# EAGLE design melvins board (EAGLE 9.2.2)
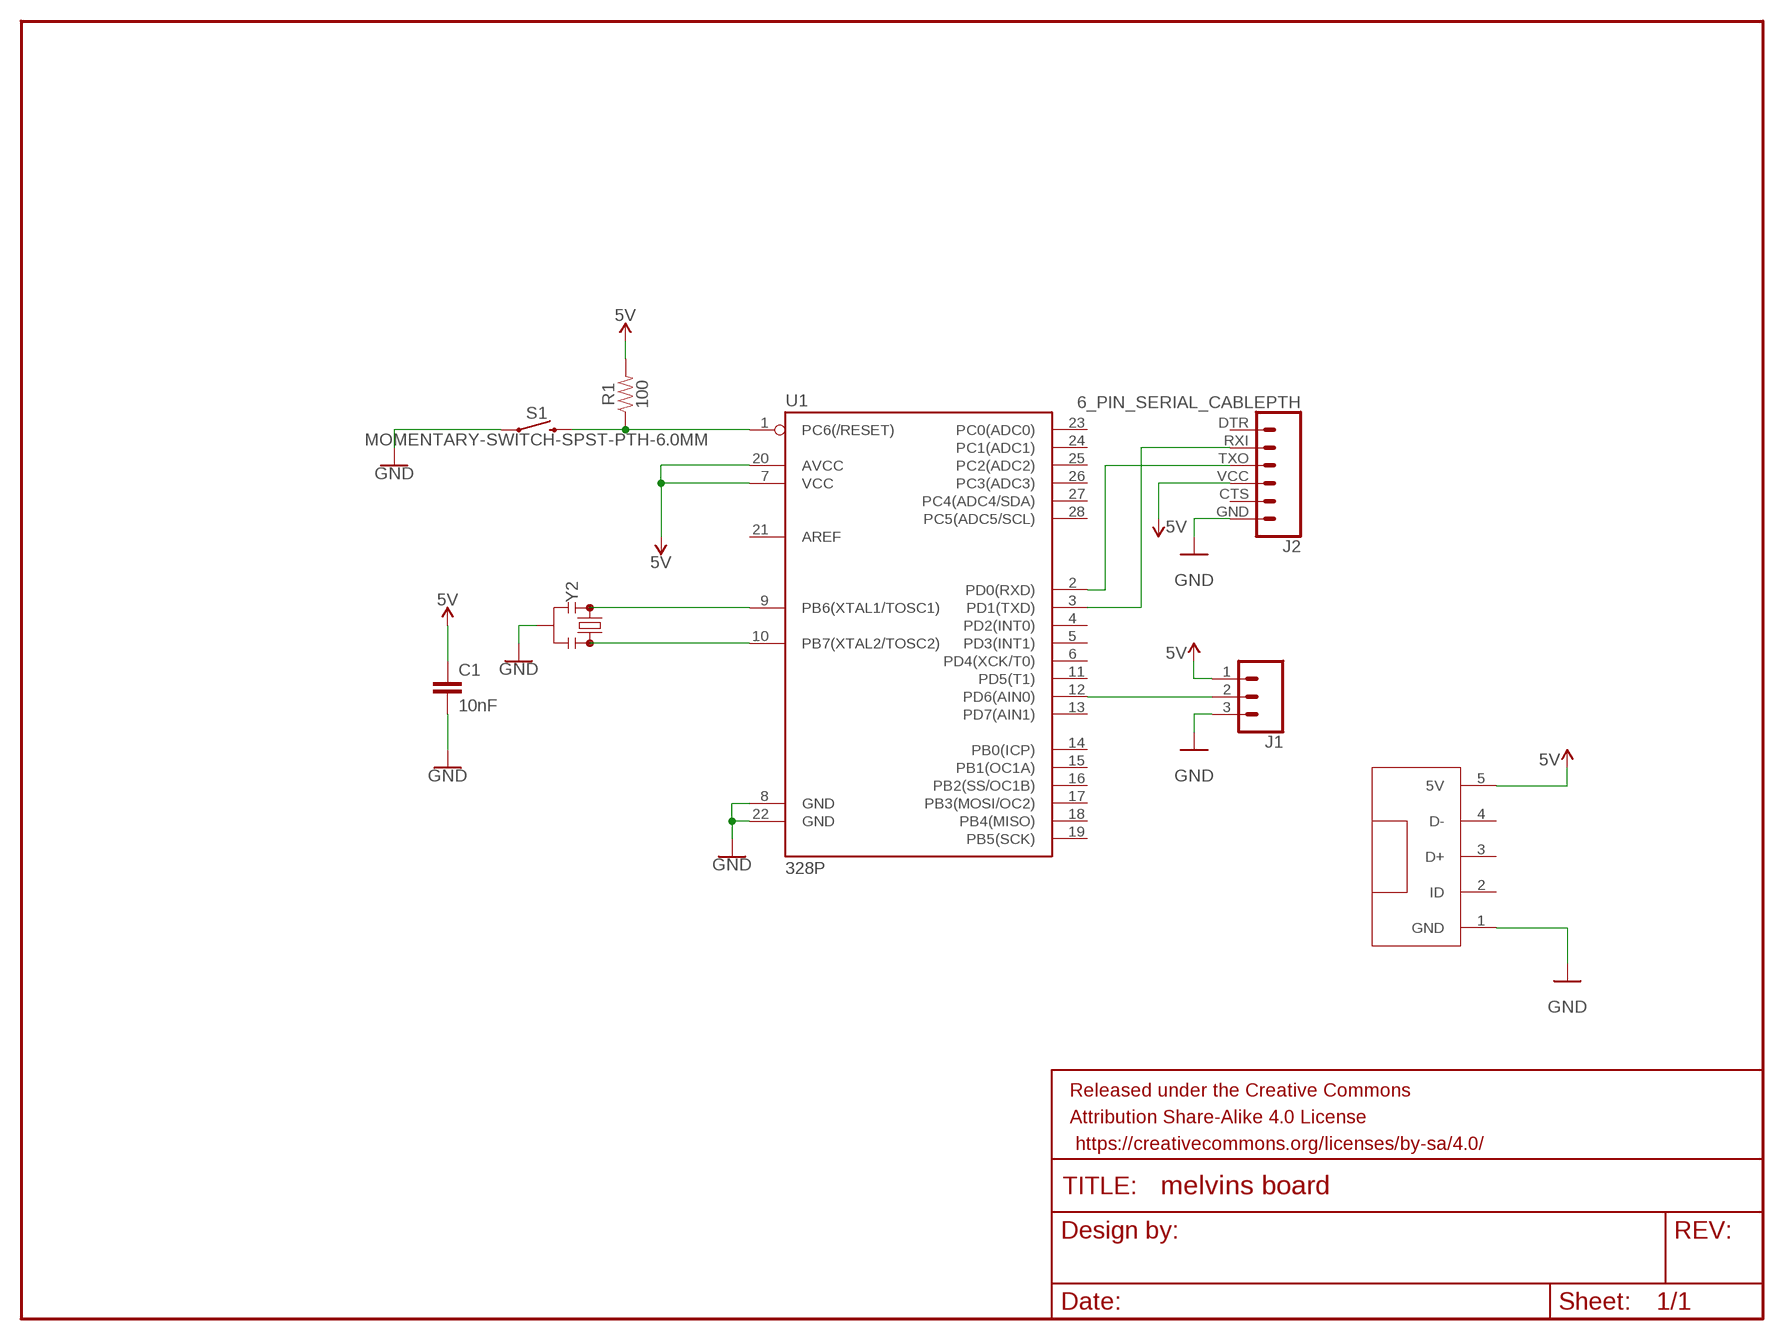
[diagram p0: schematic, sheet 1]

## Parts
C1  10nF  10NF-PTH-10MM-10000V-1-%  [CAP-PTH-10MM]
FRAME1  FRAME-LETTER  [CREATIVE_COMMONS]
J1  CONN_03  [1X03]
J2  6_PIN_SERIAL_CABLEPTH  [FTDI_BASIC]
R1  100  100OHM-HORIZ-1/4W-1%  [AXIAL-0.3]
S1  MOMENTARY-SWITCH-SPST-PTH-6.0MM  [TACTILE_SWITCH_PTH_6.0MM]
U1  328P  ATMEGA328P_PDIP  [DIP28]
U$1  USBPORT  [USB]
Y2  RESONATORPTH-7.6X3.8  [RESONATOR-PTH-7.6X3.8]

## Nets
5V: C1.1 J1.1 J2.VCC R1.P$2 U1.7(VCC) U1.20(AVCC) U$1.5(5V)
GND: C1.2 J1.3 J2.GND S1.1 U1.8(GND) U1.22(GND) U$1.1(GND) Y2.2
N$1: R1.P$1 S1.3 U1.1(PC6(/RESET))
N$2: J1.2 U1.12(PD6(AIN0))
N$3: U1.9(PB6(XTAL1/TOSC1)) Y2.1
N$4: U1.10(PB7(XTAL2/TOSC2)) Y2.3
N$6: J2.RXI U1.3(PD1(TXD))
N$7: J2.TXO U1.2(PD0(RXD))
Unconnected: J2.CTS J2.DTR U1.4(PD2(INT0)) U1.5(PD3(INT1)) U1.6(PD4(XCK/T0)) U1.11(PD5(T1)) U1.13(PD7(AIN1)) U1.14(PB0(ICP)) U1.15(PB1(OC1A)) U1.16(PB2(SS/OC1B)) U1.17(PB3(MOSI/OC2)) U1.18(PB4(MISO)) U1.19(PB5(SCK)) U1.21(AREF) U1.23(PC0(ADC0)) U1.24(PC1(ADC1)) U1.25(PC2(ADC2)) U1.26(PC3(ADC3)) U1.27(PC4(ADC4/SDA)) U1.28(PC5(ADC5/SCL)) U$1.2(ID) U$1.3(D+) U$1.4(D-)

## Library data of the parts
C1 = library eagle:10NF: 0.01uF/10nF/10,000pF ceramic capacitors A capacitor is a passive two-terminal electrical component used to store electrical energy temporarily in an electric field. CAP-09321; PROD_ID: CAP-09321
FRAME1 = SparkFun-Aesthetics:FRAME-LETTER: Schematic Frame - Letter Standard 8.5x11 US Letter frame
J1 = library eagle:CONN_03: Multi connection point. Often used as Generic Header-pin footprint for 0.1 inch spaced/style header connections On any of the 0.1 inch spaced packages, you can populate with these: Break Away Headers - Straight <https://www.sparkfun.com/products/116> (PRT-00116) Break Away Male Headers - Right Angle <https://www.sparkfun.com/products/553> (PRT-00553) Female Headers <https://www.sparkfun.com/products/115> (PRT-00115) Break Away Headers - Machine Pin <https://www.sparkfun.com/products/117> (PRT-00117) Break Away Female Headers - Swiss Machine Pin <https://www.sparkfun.com/products/743> (PRT-00743) Stackable Header - 3 Pin (Female, 0.1") <https://www.sparkfun.com/products/13875> (PRT-13875) For SCREWTERMINALS and SPRING TERMINALS visit here: Screw Terimnals on SparkFun.com <https://www.sparkfun.com/search/results?term=Screw+Terminals> (5mm/3.5mm/2.54mm spacing) This device is also useful as a general connection point to wire up your design to another part of your project. Our various solder wires solder well into these plated through hole pads. Hook-Up Wire - Assortment (Stranded, 22 AWG) <https://www.sparkfun.com/products/11375> (PRT-11375) Hook-Up Wire - Assortment (Solid Core, 22 AWG) <https://www.sparkfun.com/products/11367> (PRT-11367) View the entire wire category on our website here <https://www.sparkfun.com/categories/141> Special notes: Molex polarized connector foot print use with SKU : PRT-08232 with associated crimp pins and housings.
J2 = library eagle:6_PIN_SERIAL_CABLE: 6-pin header connection for use with the "FTDI BASIC" pinout - CABLE SIDE. Also known as "Arduino Serial Program Header". This is used on a design to provide a 6-pin connection point for serial communication usually from a USB cable (D+/D-) to these headers (RX/TX). It also has the remaining pins necessary for programming in the Arduino evironment (DTR, GND, and sometimes VCC). Note, this device has "CABLE" in the name. It is intended to be used on a design that usually lives on the end of your USB cable and prvides the converter chip (FTDI232 or FTDI231x) to commnicate serial RX/TX. The "sister" device, named "TARGET" is inteneded to be used on a design that contains a target micro-controller that you wish to program. You can populate with some of these: Female Headers <https://www.sparkfun.com/products/115> (PRT-00115) For reference (or to suit your programming needs) check out these designs: SparkFun FTDI Basic Breakout - 5V <https://www.sparkfun.com/products/9716> (DEV-09716) SparkFun FTDI Basic Breakout - 3.3V <https://www.sparkfun.com/products/9873> (DEV-09873) SparkFun FTDI SmartBasic <https://www.sparkfun.com/products/12935> (DEV-12935) SparkFun Beefy 3 - FTDI Basic Breakout <https://www.sparkfun.com/products/13746> (DEV-13746)
R1 = library eagle:100OHM: 100Ω resistor A resistor is a passive two-terminal electrical component that implements electrical resistance as a circuit element. Resistors act to reduce current flow, and, at the same time, act to lower voltage levels within circuits. - Wikipedia; PROD_ID: RES-12181
S1 = library eagle:MOMENTARY-SWITCH-SPST: Momentary Switch (Pushbutton) - SPST Normally-open (NO) SPST momentary switches (buttons, pushbuttons). Variants PTH-12MM - 12mm square, through-hole Momentary Pushbutton Switch - 12mm Square <https://www.sparkfun.com/products/9190> (COM-09190) PTH-6.0MM, PTH-6.0MM-KIT - 6.0mm square, through-hole Mini Pushbutton Switch <https://www.sparkfun.com/products/97> (COM-00097) KIT package intended for soldering kit's - only one side of pads' copper is exposed. PTH-RIGHT-ANGLE-KIT - Right-angle, through-hole Right Angle Tactile Button <https://www.sparkfun.com/products/10791> - Used on SparkFun BigTime Watch Kit <https://www.sparkfun.com/products/11734> SMD-12MM - 12mm square, surface-mount Tactile Button - SMD (12mm) <https://www.sparkfun.com/products/12993> (COM-12993) Used on SparkFun PicoBoard <https://www.sparkfun.com/products/11888> SMD-4.5MM - 4.5mm Square Trackball Switch Used on SparkFun Blackberry Trackballer Breakout <https://www.sparkfun.com/products/13169> SMD-4.6MMX2.8MM - 4.60mm x 2.80mm, surface mount Used on SparkFun SAMD21 Mini Breakout <https://www.sparkfun.com/products/13664> SMD-5.2MM, SMD-5.2-REDUNDANT - 5.2mm square, surface-mount Mini Pushbutton Switch - SMD <https://www.sparkfun.com/products/8720> (COM-08720) Used on Arduino Pro Mini <https://www.sparkfun.com/products/11114> REDUNDANT package connects both switch circuits together SMD-6.0X3.5MM - 6.0 x 3.5mm, surface mount Momentary Reset Switch SMD <https://www.sparkfun.com/products/8229> (COM-08229) SMD-6.2MM-TALL - 6.2mm square, surface mount Tactile Button - SMD (6mm) <https://www.sparkfun.com/products/12992> Used on SparkFun Digital Sandbox <https://www.sparkfun.com/products/12651> SMD-RIGHT-ANGLE - Right-angle, surface mount Used on SparkFun Block for Intel® Edison - Arduino <https://www.sparkfun.com/products/13036>; PROD_ID: SWCH-08441; SF_SKU: COM-00097
U1 = library eagle:ATMEGA328P_PDIP: Atmel 328P Through hole ATMEGA328P uC used in the Arduino 32kb flash, 1k EEPROM, 2k SRAM Datasheet <http://www.sparkfun.com/datasheets/Components/SMD/ATMega328.pdf> SparkFun Products Storefront component: AVR 28 Pin 20MHz 32K 6A/D - ATMega328P <https://www.sparkfun.com/products/9061> (COM-09061) SparkFun Simon Says - Through-Hole Soldering Kit <https://www.sparkfun.com/products/10547> (KIT-10547) SparkFun Learn to Solder - Simon Says <https://www.sparkfun.com/products/13708> (KIT-13708) SparkFun BigTime Watch Kit <https://www.sparkfun.com/products/11734> (KIT-11734) SparkFun ClockIt <https://www.sparkfun.com/products/10930> (KIT-10930) SparkFun Serial Enabled LCD Kit <https://www.sparkfun.com/products/10097> (LCD-10097) SparkFun Simon Tilts - Through Hole Soldering Kit <https://www.sparkfun.com/products/12634> (KIT-12634) SparkFun Frequency Counter Kit <https://www.sparkfun.com/products/10140> (KIT-10140) FabFM Radio Kit <https://www.sparkfun.com/products/11043> (KIT-11043) SparkFun Binary Blaster Kit <https://www.sparkfun.com/products/12037> (KIT-12037) SparkFun Metro-Gnome <https://www.sparkfun.com/products/9236> (KIT-09236) ATmega328 with Arduino Optiboot (Uno) <https://www.sparkfun.com/products/10524> (DEV-10524); PROD_ID: IC-09136
U$1 = library eagle:USBPORT
Y2 = library eagle:RESONATOR: Resonators (Generic) Ceramic resonators are clock-generating components, often used to control timing in microcontrollers. They usually have 3 pins: two pins for oscillation, and one pin for ground. Compared to crystals, resonators have worse tolerance, but are usually much cheaper. Plus, they have built-in load capacitors! These devices are used on boards like the Arduino Pro 8MHz <https://www.sparkfun.com/products/11114> and Arduino Pro 16MHz <https://www.sparkfun.com/products/11113>.

## Net classes
0 default: width 0.457 mm, drill 0.457 mm, clearance 0.457 mm

## Board
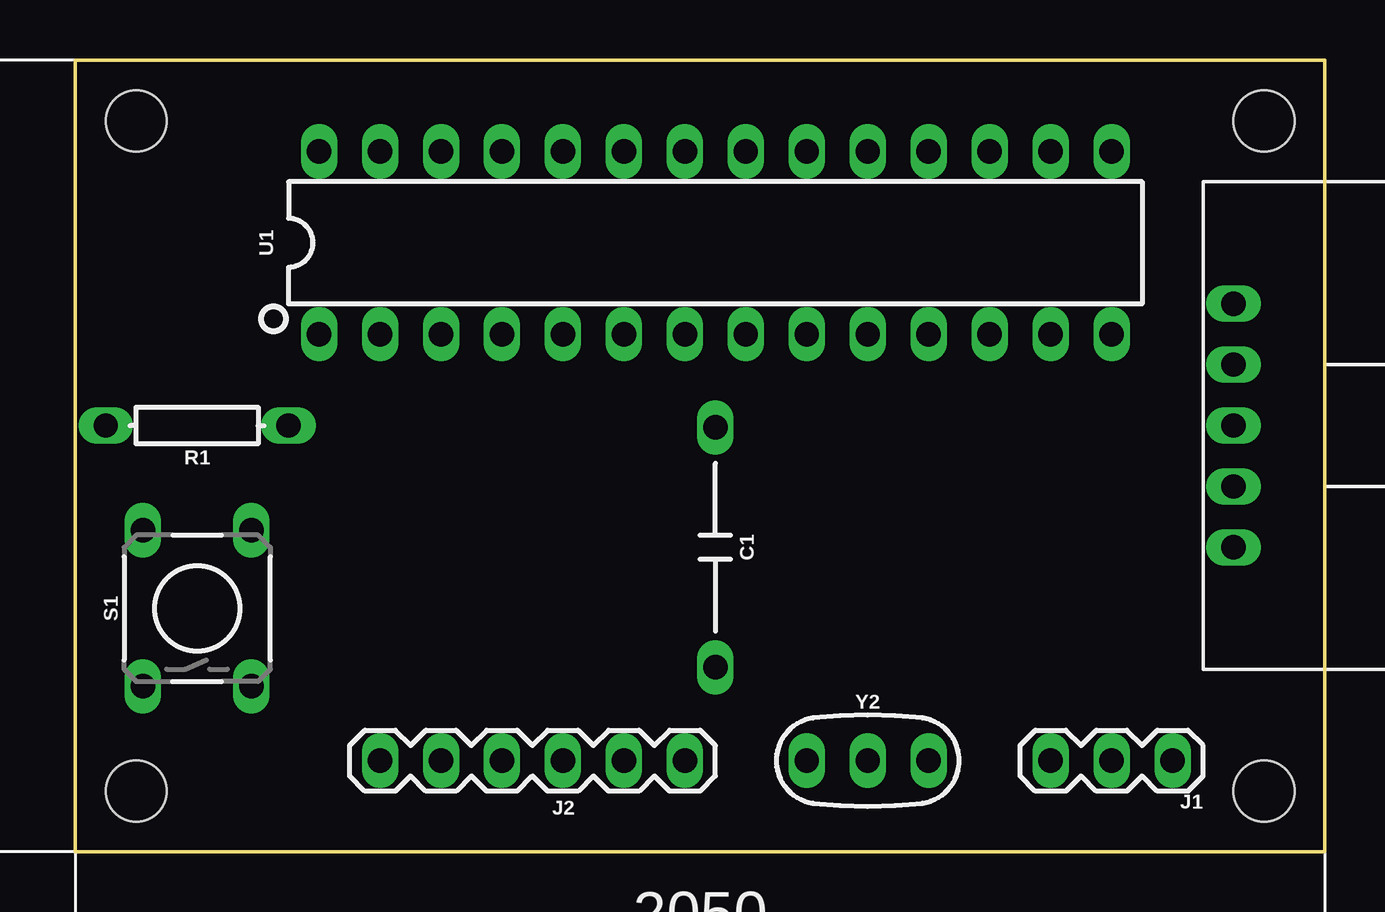
[diagram p1: board, top side]
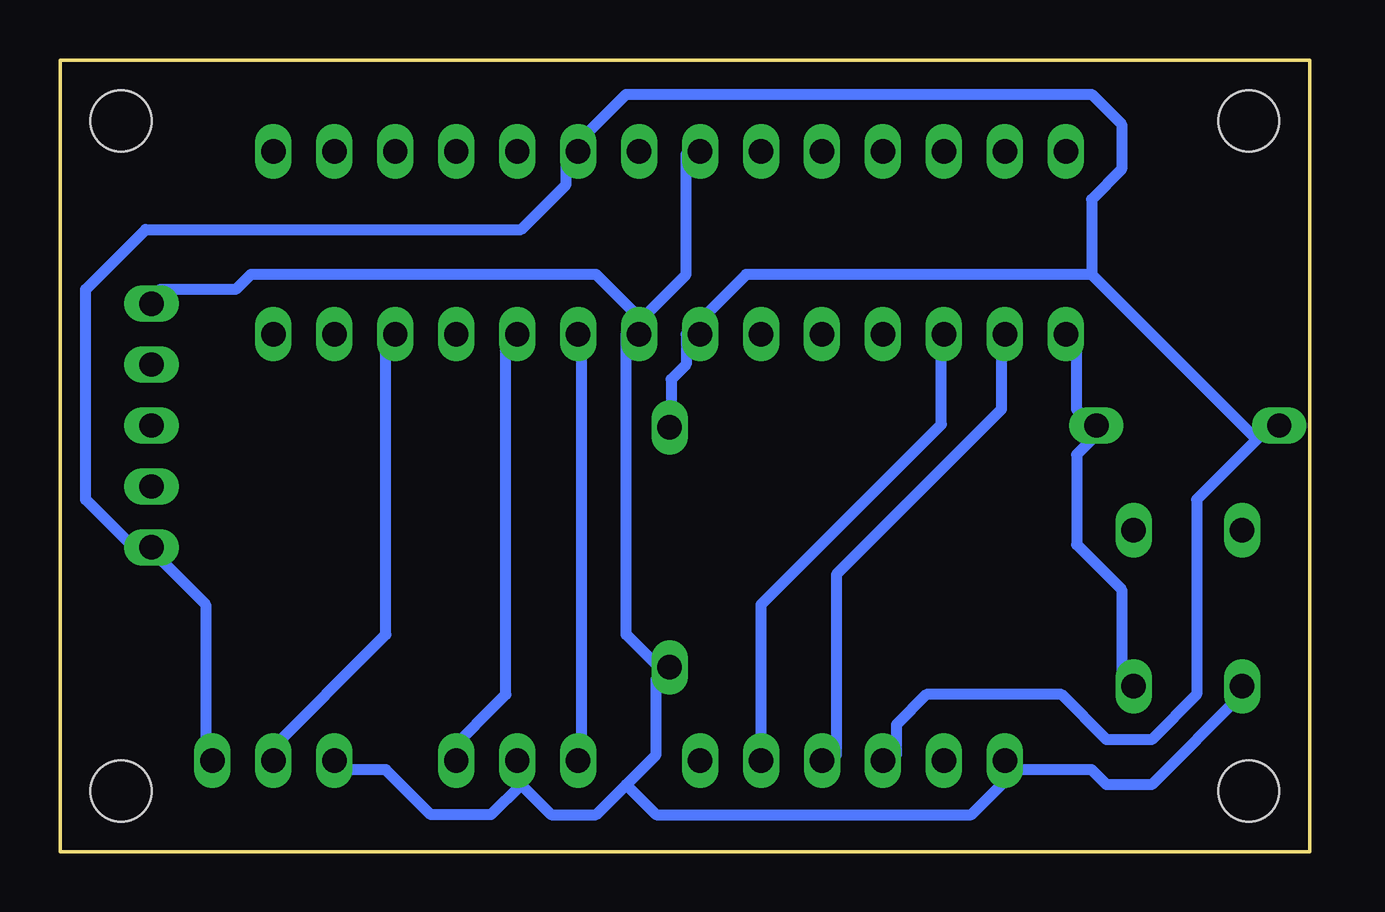
[diagram p2: board, bottom side, seen from below]

Size 52.07 x 33.02 mm. Coordinates in mm from the lower left corner, seen from the top.
Outline: 52.07,0 52.07,33.02 0,33.02 0,0 52.07,0
Copper layers (1*16): Top 0.035mm / dielectric 1.5mm / Bottom 0.035mm
Design rules "OthermillDRC_1_32_v2": minimum track width 8mil, minimum drill 0.8mm, track to track 0.794003125mm, track to pad 0.794003125mm, pad to pad 0.794003125mm, via to via 0.794003125mm, smd to smd 0mil, copper to edge 0mil, drill to drill 1mil, minimum pad ring 10mil, minimum via ring 10mil, stop-mask expansion 1mil, vias tented up to drill 30mil, thermal gap 10mil
Holes 2.54 mm at 2.54,30.48 2.54,2.54 49.53,2.54 49.53,30.48

### Footprints (pad centres in the part's own frame; a part is rotated, then mirrored left to right if it is on the bottom)
CAP-PTH-10MM = drill 1.016 long: 1 -5,0; 2 5,0
1X03 = drill 1.016 long: 1 0,0; 2 2.54,0; 3 5.08,0
FTDI_BASIC = drill 1.016 long: CTS 10.16,0; DTR 0,0; GND 12.7,0; RXI 2.54,0; TXO 5.08,0; VCC 7.62,0
AXIAL-0.3 = drill 1.016 long: P$1 -3.81,0; P$2 3.81,0
TACTILE_SWITCH_PTH_6.0MM = drill 1.016 long: 1 -3.251,2.261; 2 3.251,2.261; 3 -3.251,-2.261; 4 3.251,-2.261
DIP28 = drill 1.016 long: 1 -16.51,-3.81; 2 -13.97,-3.81; 3 -11.43,-3.81; 4 -8.89,-3.81; 5 -6.35,-3.81; 6 -3.81,-3.81; 7 -1.27,-3.81; 8 1.27,-3.81; 9 3.81,-3.81; 10 6.35,-3.81; 11 8.89,-3.81; 12 11.43,-3.81; 13 13.97,-3.81; 14 16.51,-3.81; 15 16.51,3.81; 16 13.97,3.81; 17 11.43,3.81; 18 8.89,3.81; 19 6.35,3.81; 20 3.81,3.81; 21 1.27,3.81; 22 -1.27,3.81; 23 -3.81,3.81; 24 -6.35,3.81; 25 -8.89,3.81; 26 -11.43,3.81; 27 -13.97,3.81; 28 -16.51,3.81
USB = drill 1.016 long: 1 15.24,8.89; 2 12.7,8.89; 3 10.16,8.89; 4 7.62,8.89; 5 5.08,8.89
RESONATOR-PTH-7.6X3.8 = drill 1.016 long: 1 -2.54,0; 2 0,0; 3 2.54,0

### Placement (x,y rotation side)
C1  26.67,12.7 270 top
FRAME1  -140.97,7.62 0 top  (outside the outline)
J1  45.72,3.81 180 top
J2  25.4,3.81 180 top
R1  5.08,17.78 180 top
S1  5.08,10.16 90 top
U1  26.67,25.4 0 top
U$1  57.15,7.62 90 top
Y2  33.02,3.81 0 top

### Tracks (layer width: path | path; a pad name or v marks a point on that pad's centre or on a via)
5V
  Bottom 0.457: C1.1 26.6,17.82 26.6,19.7 25.98,20.32 25.98,21.58 U1.7 25.35,22.2 23.48,24.08 9.09,24.08 | 2.21,17.2 1.58,17.82 R1.P$2 | 2.21,17.2 4.71,14.69 4.71,6.56 6.59,4.68 8.46,4.68 10.34,6.56 15.97,6.56 17.22,5.31 17.22,4.06 J2.VCC | 2.21,17.2 9.09,24.08 | J1.1 46,4.06 46,10.32 47.88,12.19 U$1.5 48.5,12.19 51,14.69 51,23.45 48.5,25.96 32.86,25.96 30.98,27.83 30.98,29.08 U1.20 30.36,29.71 28.48,31.59 9.09,31.59 7.84,30.33 7.84,28.46 9.09,27.21 9.09,24.08
GND
  Bottom 0.457: 27.86,22.2 25.98,24.08 25.98,29.08 U1.22 | 27.86,22.2 29.73,24.08 44.12,24.08 44.75,23.45 47.88,23.45 U$1.1 | 27.86,22.2 U1.8 28.48,21.58 28.48,9.06 27.23,7.81 C1.2 27.23,7.19 27.23,4.06 28.48,2.81 | S1.1 2.83,6.56 6.59,2.81 8.46,2.81 9.09,3.43 12.22,3.43 J2.GND 12.84,3.43 12.84,2.81 14.09,1.56 27.23,1.56 28.48,2.81 | 28.48,2.81 29.73,1.56 31.61,1.56 32.86,2.81 | 32.86,2.81 33.49,3.43 Y2.2 32.86,2.81 | 32.86,2.81 34.11,1.56 36.62,1.56 38.49,3.43 40.37,3.43 J1.3
N$1
  Bottom 0.457: S1.3 7.84,7.19 7.84,10.94 9.71,12.82 9.71,16.57 9.09,17.2 R1.P$1 9.09,17.82 9.71,18.45 9.71,21.58 U1.1
N$2
  Bottom 0.457: U1.12 38.49,21.58 38.49,9.06 43.5,4.06 J1.2
N$3
  Bottom 0.457: Y2.1 30.36,4.06 30.36,21.58 U1.9
N$4
  Bottom 0.457: U1.10 33.49,21.58 33.49,6.56 35.99,4.06 Y2.3
N$6
  Bottom 0.457: U1.3 15.34,21.58 15.34,17.82 22.85,10.32 22.85,4.06 J2.RXI
N$7
  Bottom 0.457: J2.TXO 19.72,4.06 19.72,11.57 12.84,18.45 12.84,21.58 U1.2